# Altium project RFID_P5.PrjPcb (part 1 of 2)
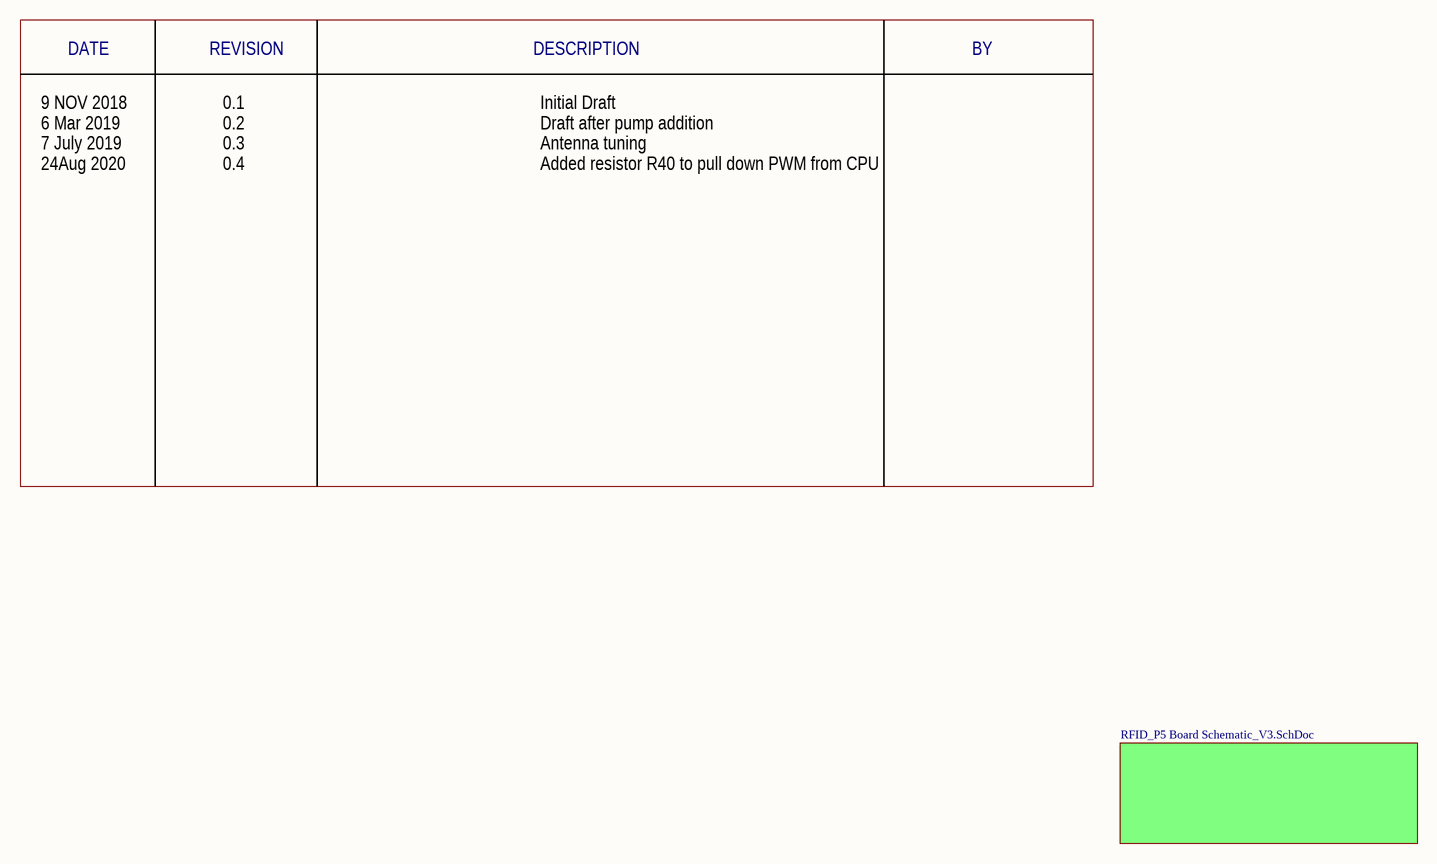
[diagram p0: Revision History.SchDoc]
7 sheets, 289 parts. Net scope: hierarchical (ports join the sheet entries above them; power ports are global).
Board file: RFID_P5 PCB.PcbDoc
Sheets:
  Revision History.SchDoc
  RFID_P5 Board Schematic.SchDoc
    RFID = RFID_CU Schematic.SchDoc
    MCU = MCU_CU Schematic.SchDoc
    POWER = Power_CU Schematic.SchDoc
    CONN = Connector_CU Schematic.SchDoc
    PUMP = PUMP DRIVER Schematic.SchDoc

## Sheet Revision History.SchDoc: Title
size A3; Date: *******; ApprovedBy: *******; CheckedBy: None; Author: *******; CompanyName: *******; DrawnBy: Name; Engineer: *******; Organization: *******; Address1: *******; Address2: *******; Address3: *******; Address4: *******; DocumentNumber: Doc Num; Revision: *******; SheetNumber: 1; SheetTotal: *******; CurrentTime: *******; CurrentDate: *******; Time: *******; DocumentFullPathAndName: *******; DocumentName: *******; ModifiedDate: *******; ImagePath: *******; ProjectName: *******; Application_BuildNumber: *******

### Sub-sheets
? = RFID_P5 Board Schematic_V3.SchDoc (file not in this document): no entries

### Notes on the sheet
- DATE
- REVISION
- DESCRIPTION
- BY
- 9 NOV 2018
- 6 Mar 2019
- 0.1
- 0.2
- Initial Draft
- Draft after pump addition
- 7 July 2019
- 24Aug 2020
- 0.3
- 0.4
- Antenna tuning
- Added resistor R40 to pull down PWM from CPU
- Title:
- Drawn By:
- Page Contents:
- Ahmed - AA
- Checked By:
- Size:
- Date:
- File:
- License:
- Email:
- A4
- Number:
- Time:
- Revision:
- Sheet
- Website:
- of

## Sheet RFID_P5 Board Schematic.SchDoc: Title
size A3; SheetTitle: Project Schematic; ApprovalDate: dd/mm/yyyy; DesignedBy: Boris Sharff; PartName: RFID_P5 CU board; PageSetup: Record=PageOptions|CenterHorizontal=True|CenterVertical=True|PrintScale=1.00|XCorrection=1.00|YCorrection=1.00|PrintKind=1|BorderSize=5000000|LeftOffset=0|BottomOffset=0|Orientation=2|PaperLength=1000|PaperWidth=1000|Scale=100|PaperSource=7|PrintQuality=-3|MediaType=1|DitherType=10|PrintScaleMode=0|PaperKind=A4|PaperIndex=9; Title2: RFDID_P5 CU Board Project Schematic; Date: *******; ApprovedBy: *******; CheckedBy: None; Author: *******; CompanyName: *******; DrawnBy: Name; Engineer: *******; Organization: *******; Address1: *******; Address2: *******; Address3: *******; Address4: *******; DocumentNumber: Doc Num; Revision: *******; SheetNumber: 1; SheetTotal: *******; CurrentTime: *******; CurrentDate: *******; Time: *******; DocumentFullPathAndName: *******; DocumentName: *******; ModifiedDate: *******; ImagePath: *******; ProjectName: *******; Application_BuildNumber: *******
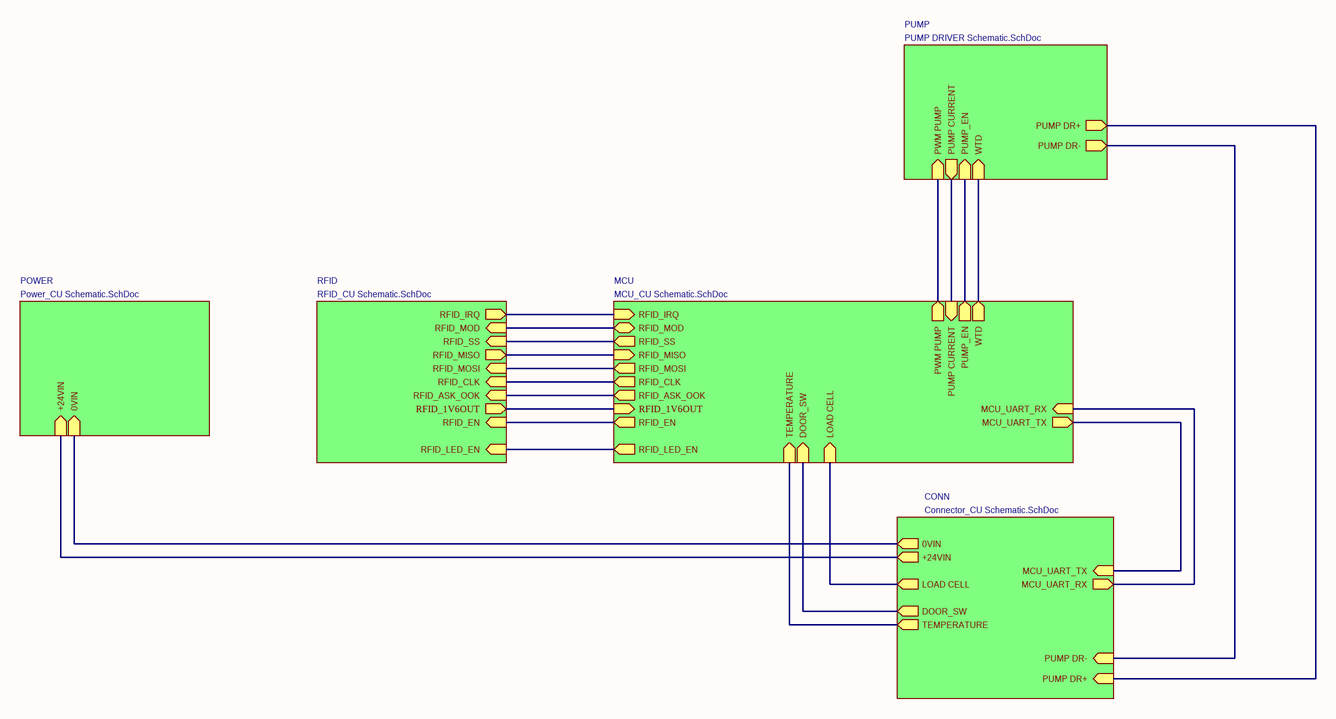
[diagram p1: RFID_P5 Board Schematic.SchDoc]

### Sub-sheets
CONN = Connector_CU Schematic.SchDoc: DOOR_SW (out), LOAD CELL (out), 0VIN (out), +24VIN (out), MCU_UART_RX (out), MCU_UART_TX (in), TEMPERATURE (out), PUMP DR+ (in), PUMP DR- (in)
MCU = MCU_CU Schematic.SchDoc: RFID_CLK (out), RFID_IRQ (in), RFID_EN (out), MCU_UART_TX (out), RFID_SS (out), RFID_MOD (bidir), MCU_UART_RX (in), DOOR_SW (in), RFID_MISO (in), RFID_MOSI (out), RFID_LED_EN (out), RFID_ASK_OOK (out), LOAD CELL (in), TEMPERATURE (in), RFID_1V6OUT (in), PWM PUMP (out), PUMP CURRENT (in), PUMP_EN (out), WTD (out)
POWER = Power_CU Schematic.SchDoc: +24VIN (in), 0VIN (in)
PUMP = PUMP DRIVER Schematic.SchDoc: PUMP DR- (out), PUMP DR+ (out), PWM PUMP (in), PUMP CURRENT (out), PUMP_EN (in), WTD (in)
RFID = RFID_CU Schematic.SchDoc: RFID_IRQ (out), RFID_SS (in), RFID_EN (in), RFID_CLK (in), RFID_MOD (in), RFID_LED_EN (in), RFID_MOSI (in), RFID_MISO (out), RFID_ASK_OOK (in), RFID_1V6OUT (out)

### Nets
0VIN: sheet POWER/0VIN, sheet CONN/0VIN
+24VIN: sheet POWER/+24VIN, sheet CONN/+24VIN
RFID_ASK_OOK: sheet RFID/RFID_ASK_OOK, sheet MCU/RFID_ASK_OOK
RFID_CLK: sheet RFID/RFID_CLK, sheet MCU/RFID_CLK
RFID_EN: sheet RFID/RFID_EN, sheet MCU/RFID_EN
RFID_IRQ: sheet RFID/RFID_IRQ, sheet MCU/RFID_IRQ
RFID_LED_EN: sheet RFID/RFID_LED_EN, sheet MCU/RFID_LED_EN
RFID_MISO: sheet RFID/RFID_MISO, sheet MCU/RFID_MISO
RFID_MOD: sheet RFID/RFID_MOD, sheet MCU/RFID_MOD
RFID_MOSI: sheet RFID/RFID_MOSI, sheet MCU/RFID_MOSI
RFID_SS: sheet RFID/RFID_SS, sheet MCU/RFID_SS
NetC3_1: sheet MCU/DOOR_SW, sheet CONN/DOOR_SW
NetC8_1: sheet MCU/LOAD CELL, sheet CONN/LOAD CELL
NetC85_2: sheet RFID/RFID_1V6OUT, sheet MCU/RFID_1V6OUT
NetC99_1: sheet MCU/TEMPERATURE, sheet CONN/TEMPERATURE
NetC108_1: sheet CONN/PUMP DR+, sheet PUMP/PUMP DR+
NetJ6_1: sheet CONN/PUMP DR-, sheet PUMP/PUMP DR-
NetR40_2: sheet MCU/PWM PUMP, sheet PUMP/PWM PUMP
NetTP3_TP: sheet MCU/MCU_UART_TX, sheet CONN/MCU_UART_TX
NetTP5_TP: sheet MCU/MCU_UART_RX, sheet CONN/MCU_UART_RX
NetU4_20: sheet MCU/WTD, sheet PUMP/WTD
NetU4_21: sheet MCU/PUMP_EN, sheet PUMP/PUMP_EN
NetU4_79: sheet MCU/PUMP CURRENT, sheet PUMP/PUMP CURRENT

### Notes on the sheet
- Title:
- Drawn By:
- Page Contents:
- Ahmed - AA
- Checked By:
- Size:
- Date:
- File:
- License:
- Email:
- A4
- Number:
- Time:
- Revision:
- Sheet
- Website:
- of

## Sheet RFID_CU Schematic.SchDoc: Title
size A3; ApprovalDate: dd/mm/yyyy; PageSetup: Record=PageOptions|CenterHorizontal=True|CenterVertical=True|PrintScale=1.01|XCorrection=1.00|YCorrection=1.00|PrintKind=1|BorderSize=5000000|LeftOffset=0|BottomOffset=0|Orientation=2|PaperLength=1000|PaperWidth=1000|Scale=100|PaperSource=7|PrintQuality=600|MediaType=1|DitherType=10|PaperKind=A3 (297 x 420mm)|PrintScaleMode=1; Title2: RFID_CU Schematic; Date: *******; ApprovedBy: *******; CheckedBy: None; Author: *******; CompanyName: *******; DrawnBy: Name; Engineer: *******; Organization: *******; Address1: *******; Address2: *******; Address3: *******; Address4: *******; DocumentNumber: Doc Num; Revision: *******; SheetNumber: 1; SheetTotal: *******; CurrentTime: *******; CurrentDate: *******; Time: *******; DocumentFullPathAndName: *******; DocumentName: *******; ModifiedDate: *******; ImagePath: *******; ProjectName: *******; Application_BuildNumber: *******
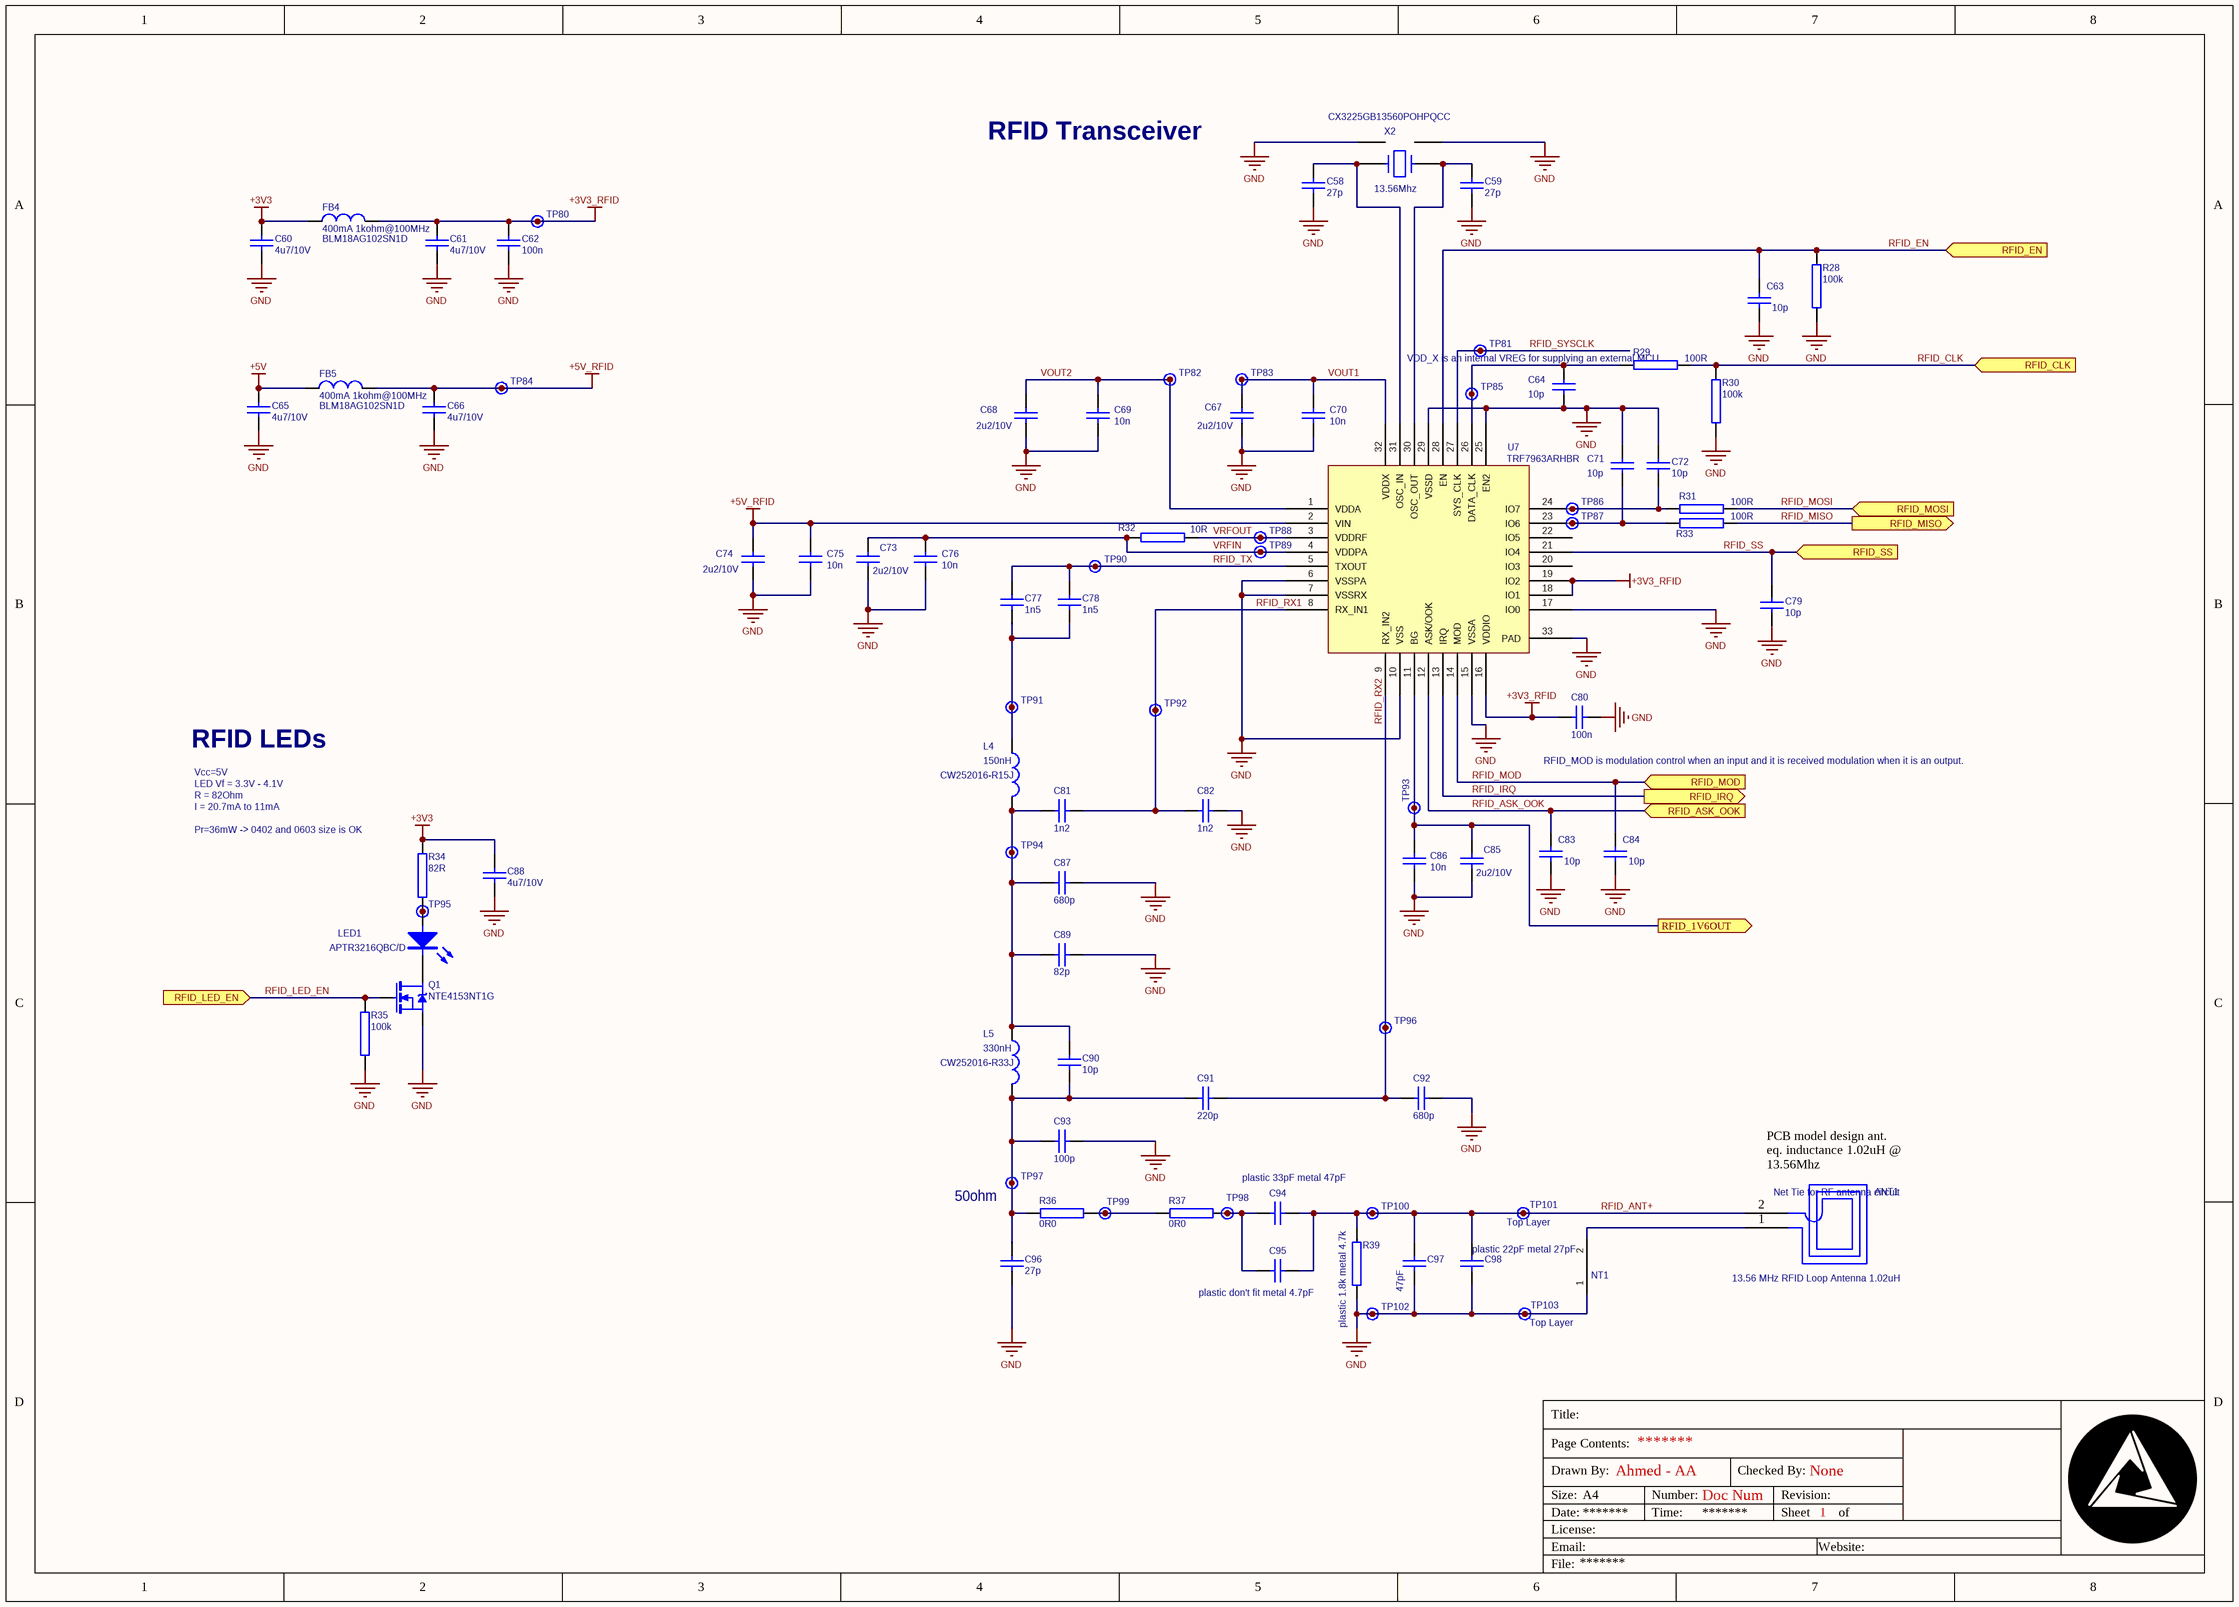
[diagram p2: RFID_CU Schematic.SchDoc]

### Parts
ANT1  Loop Antenna  [loop_antenna]  (value not drawn)
C58  27p  [CAPC1608X09N(0603)]
C59  27p  [CAPC1608X09N(0603)]
C60  4u7/10V  [CAPC1608X09N(0603)]
C61  4u7/10V  [CAPC1608X09N(0603)]
C62  100n  [CAPC1608X09N(0603)]
C63  10p  [CAPC1608X09N(0603)]
C64  10p  [CAPC1608X09N(0603)]
C65  4u7/10V  [CAPC1608X09N(0603)]
C66  4u7/10V  [CAPC1608X09N(0603)]
C67  2u2/10V  [CAPC1608X09N(0603)]
C68  2u2/10V  [CAPC1608X09N(0603)]
C69  10n  [CAPC1608X09N(0603)]
C70  10n  [CAPC1608X09N(0603)]
C71  10p  [CAPC1608X09N(0603)]
C72  10p  [CAPC1608X09N(0603)]
C73  2u2/10V  [CAPC1608X09N(0603)]
C74  2u2/10V  [CAPC1608X09N(0603)]
C75  10n  [CAPC1608X09N(0603)]
C76  10n  [CAPC1608X09N(0603)]
C77  1n5  [CAPC1608X09N(0603)]
C78  1n5  [CAPC1608X09N(0603)]
C79  10p  [CAPC1608X09N(0603)]
C80  100n  [CAPC1608X09N(0603)]
C81  1n2  [CAPC1608X09N(0603)]
C82  1n2  [CAPC1608X09N(0603)]
C83  10p  [CAPC1608X09N(0603)]
C84  10p  [CAPC1608X09N(0603)]
C85  2u2/10V  [CAPC1608X09N(0603)]
C86  10n  [CAPC1608X09N(0603)]
C87  680p  [CAPC1608X09N(0603)]
C88  4u7/10V  [CAPC1608X09N(0603)]
C89  82p  [CAPC1608X09N(0603)]
C90  10p  [CAPC1608X09N(0603)]
C91  220p  [CAPC1608X09N(0603)]
C92  680p  [CAPC1608X09N(0603)]
C93  100p  [CAPC1608X09N(0603)]
C94  plastic 33pF metal 47pF  [CAPC1608X09N(0603)]
C95  plastic don't fit metal 4.7pF  [CAPC1608X09N(0603)]
C96  27p  [CAPC1608X09N(0603)]
C97  47pF  [CAPC1608X09N(0603)]
C98  plastic 22pF metal 27pF  [CAPC1608X09N(0603)]
FB4  400mA 1kohm@100MHz  [RESC1608X06N]
FB5  400mA 1kohm@100MHz  [RESC1608X06N]
L4  150nH  02 Part Number: CW252016-R15J  [CW252016]
L5  330nH  02 Part Number: CW252016-R33J  [CW252016]
LED1  APTR3216QBC/D  [APTR3216QBC/D]
NT1  Net Tie  [0.15mm Net Tie]  (value not drawn)  (net tie, no BOM)
Q1  NTE4153NT1G  [SC-89]
R28  100k  [RESC1608X06N(0603)]
R29  100R  [RESC1608X06N(0603)]
R30  100k  [RESC1608X06N(0603)]
R31  100R  [RESC1608X06N(0603)]
R32  10R  [RESC1608X06N(0603)]
R33  100R  [RESC1608X06N(0603)]
R34  82R  [RESC1608X06N(0603)]
R35  100k  [RESC1608X06N(0603)]
R36  0R0  [RESC1608X06N(0603)]
R37  0R0  [RESC1608X06N(0603)]
R39  plastic 1.8k metal 4.7k  [RESC1608X06N(0603)]
TP80  LFX_P  [Test Point 1mm]  (value not drawn)  (no BOM)
TP81  LFX_P  [Test Point 1mm]  (value not drawn)  (no BOM)
TP82  LFX_P  [Test Point 1mm]  (value not drawn)  (no BOM)
TP83  LFX_P  [Test Point 1mm]  (value not drawn)  (no BOM)
TP84  LFX_P  [Test Point 1mm]  (value not drawn)  (no BOM)
TP85  LFX_P  [Test Point 1mm]  (value not drawn)  (no BOM)
TP86  LFX_P  [Test Point 1mm]  (value not drawn)  (no BOM)
TP87  LFX_P  [Test Point 1mm]  (value not drawn)  (no BOM)
TP88  LFX_P  [Test Point 1mm]  (value not drawn)  (no BOM)
TP89  LFX_P  [Test Point 1mm]  (value not drawn)  (no BOM)
TP90  LFX_P  [Test Point 1mm]  (value not drawn)  (no BOM)
TP91  LFX_P  [Test Point 1mm]  (value not drawn)  (no BOM)
TP92  LFX_P  [Test Point 1mm]  (value not drawn)  (no BOM)
TP93  LFX_P  [Test Point 1mm]  (value not drawn)  (no BOM)
TP94  LFX_P  [Test Point 1mm]  (value not drawn)  (no BOM)
TP95  LFX_P  [Test Point 1mm]  (value not drawn)  (no BOM)
TP96  LFX_P  [Test Point 1mm]  (value not drawn)  (no BOM)
TP97  50ohm  [Test Point 1mm]  (no BOM)
TP98  LFX_P  [Test Point 1mm]  (value not drawn)  (no BOM)
TP99  LFX_P  [Test Point 1mm]  (value not drawn)  (no BOM)
TP100  LFX_P  [Test Point 1mm]  (value not drawn)  (no BOM)
TP101  Notes: Top Layer  [Test Point 1mm]  (hidden comment: LFX_P)  (no BOM)
TP102  LFX_P  [Test Point 1mm]  (value not drawn)  (no BOM)
TP103  Notes: Top Layer  [Test Point 1mm]  (hidden comment: LFX_P)  (no BOM)
U7  TRF7963ARHBR  [QFN-32]
X2  13.56Mhz  02 Part Number: CX3225GB13560POHPQCC  [CX3225GB13560D0HEQCC]

### Ports
RFID_1V6OUT (out), RFID_ASK_OOK (in), RFID_CLK (in), RFID_EN (in), RFID_IRQ (out), RFID_LED_EN (in), RFID_MISO (out), RFID_MOD (in), RFID_MOSI (in), RFID_SS (in)

### Nets
+3V3: C60.2 C88.2 FB4.1 R34.2
+3V3_RFID: C61.2 C62.2 C80.2 FB4.2 TP80.TP U7.16(VDDIO) U7.18(IO1) U7.19(IO2)
+5V: C65.2 FB5.1
+5V_RFID: C66.2 C74.2 C75.2 FB5.2 TP84.TP U7.2(VIN)
GND: C58.1 C59.1 C60.1 C61.1 C62.1 C63.2 C64.2 C65.1 C66.1 C67.1 C68.1 C69.1 C70.1 C71.1 C72.1 C73.1 C74.1 C75.1 C76.1 C79.2 C80.1 C82.1 C83.2 C84.2 C85.1 C86.1 C87.1 C88.1 C89.1 C92.1 C93.1 C96.1 C97.2 C98.2 NT1.1 Q1.S R28.1 R30.1 R35.1 R39.1 TP102.TP TP103.TP U7.6(VSSPA) U7.7(VSSRX) U7.10(VSS) U7.15(VSSA) U7.17(IO0) U7.25(EN2) U7.29(VSSD) U7.33(PAD) X2.2 X2.4  [project net AN GND]
RFID_ANT+: C94.1 C95.1 C97.1 C98.1 R39.2 TP100.TP TP101.TP
RFID_ASK_OOK: C83.1 U7.12(ASK/OOK) ; port RFID_ASK_OOK
RFID_CLK: R29.2 R30.2 ; port RFID_CLK
RFID_EN: C63.1 R28.2 U7.28(EN) ; port RFID_EN
RFID_IRQ: U7.13(IRQ) ; port RFID_IRQ
RFID_LED_EN: Q1.G R35.2 ; port RFID_LED_EN
RFID_MISO: R33.2 ; port RFID_MISO
RFID_MOD: C84.1 U7.14(MOD) ; port RFID_MOD
RFID_MOSI: R31.2 ; port RFID_MOSI
RFID_RX1: C81.1 C82.2 TP92.TP U7.8(RX_IN1)
RFID_RX2: C91.1 C92.2 TP96.TP U7.9(RX_IN2)
RFID_SS: C79.1 U7.21(IO4) ; port RFID_SS
RFID_SYSCLK: TP81.TP U7.27(SYS_CLK)
RFID_TX: C77.2 C78.2 TP90.TP U7.5(TXOUT)
VOUT1: C67.2 C70.2 TP83.TP U7.32(VDDX)
VOUT2: C68.2 C69.2 TP82.TP U7.1(VDDA)
VRFIN: C73.2 C76.2 R32.1 TP89.TP U7.4(VDDPA)
VRFOUT: R32.2 TP88.TP U7.3(VDDRF)
NetC58_2: C58.2 U7.31(OSC_IN) X2.3
NetC59_2: C59.2 U7.30(OSC_OUT) X2.1
NetC64_1: C64.1 R29.1 TP85.TP U7.26(DATA_CLK)
NetC71_2: C71.2 R33.1 TP87.TP U7.23(IO6)
NetC72_2: C72.2 R31.1 TP86.TP U7.24(IO7)
NetC77_1: C77.1 C78.1 L4.1 TP91.TP
NetC81_2: C81.2 C87.2 C89.2 C90.1 L4.2 L5.1 TP94.TP
NetC85_2: C85.2 C86.2 TP93.TP U7.11(BG) ; port RFID_1V6OUT
NetC90_2: C90.2 C91.2 C93.2 C96.2 L5.2 R36.1 TP97.TP
NetC94_2: C94.2 C95.2 R37.2 TP98.TP
NetLED1_A: LED1.A R34.1 TP95.TP
NetLED1_K: LED1.K Q1.D
NetR36_2: R36.2 R37.1 TP99.TP

Not connected (* = marked no-connect by the designer): ANT1 1 2; NT1 2; U7 20(IO3) 22(IO5)

### Notes on the sheet
- RFID Transceiver
- VDD_X is an internal VREG for supplying an external MCU
- RFID LEDs
- (near C80) RFID_MOD is modulation control when an input and it is received modulation when it is an output.
- (near R34) Vcc=5V
  LED Vf = 3.3V - 4.1V
  R = 82Ohm
  I = 20.7mA to 11mA
  Pr=36mW -> 0402 and 0603 size is OK
- (near ANT1) PCB model design ant. eq. inductance 1.02uH @ 13.56Mhz
- (near ANT1) Net Tie for RF antenna circuit
- (near ANT1) 13.56 MHz RFID Loop Antenna 1.02uH
- Title:
- Drawn By:
- Page Contents:
- Ahmed - AA
- Checked By:
- Size:
- Date:
- File:
- License:
- Email:
- A4
- Number:
- Time:
- Revision:
- Sheet
- Website:
- of

### Library data of the parts
ANT1 = LOOP ANT: FPC Loop Antenna; 02 Part Number: P0000475; 01 Part Category: Atenna; 12 Author: M.Fineschi; 03 Description: FPC Loop Antenna; 04 Value: P0000475
C58 C59 = GRM1885C1H180FA01D: Capacitor, Ceramic, 50V, Tin plated, ±1%, ±30ppm/C, C0G, 100mohm, -55°C to 125°C; 08 Manufacturer: Murata Electronics North America; 04 Value: 18p; 06 Package: 0603; 12 Author: D.Grace; 05 Footprint Type: SMD; 02 Part Number: GRM1885C1H180FA01D; 03 Description: Capacitor, Ceramic, 50V, Tin plated, ±1%, ±30ppm/C, C0G, 100mohm, -55°C to 125°C; 01 Part Category: Capacitor; 09 Digikey PN: GRM1885C1H180FA01D-ND; 10 Alternate Supplier: Mouser; 11 Alternate Supplier PN: 81-GRM1885C1H180FA; ComponentLink1Description: Datasheet; ComponentLink1URL: L:\Datasheet\Capacitor\Chip Monolithic Ceramic Caps.pdf
C60 C61 C65 C66 C88 = CC0603KRX5R6BB475: Capacitor, Ceramic, 10V, ±10%, X5R, -55°C to 125°C; 08 Manufacturer: Yageo; 04 Value: 4u7; 06 Package: 0603; 12 Author: K.Sukumar; 05 Footprint Type: SMD; 02 Part Number: CC0603KRX5R6BB475; 03 Description: Capacitor, Ceramic, 10V, ±10%, X5R, -55°C to 125°C; 01 Part Category: Capacitor; 09 Digikey PN: 311-1455-2-ND; ComponentLink1Description: Datasheet; ComponentLink1URL: L:\Datasheet\Capacitor\mlcc01_e.pdf
C62 C80 = GRM188R71H104KA93D: Capacitor, Ceramic, 50V, ±10%, X7R, -55°C to 125°C; 08 Manufacturer: Murata Electronics North America; 06 Package: 0603; 12 Author: D.Grace; 05 Footprint Type: SMD; 02 Part Number: GRM188R71H104KA93D; 03 Description: Capacitor, Ceramic, 50V, ±10%, X7R, -55°C to 125°C; 04 Value: 100n; 01 Part Category: Capacitor; 09 Digikey PN: 490-1519-2-ND; ComponentLink1Description: Datasheet; ComponentLink1URL: L:\Datasheet\Capacitor\c02e.pdf
C63 C64 C71 C72 C79 C83 C84 C90 = GQM1885C1H100JB01D: Capacitor, Ceramic, 50V, ±5%, NP0, -55°C to 125°C; 08 Manufacturer: Murata Electronics North America; 06 Package: 0603; 12 Author: M.Fineschi; 05 Footprint Type: SMD; 02 Part Number: GQM1885C1H100JB01D; 03 Description: Capacitor, Ceramic, 50V, ±5%, NP0, -55°C to 125°C; 04 Value: 10p; 01 Part Category: Capacitor; 09 Digikey PN: 490-3570-1-ND; ComponentLink1Description: Datasheet; ComponentLink1URL: L:\Datasheet\Capacitor\c02e.pdf
C67 C68 C73 C74 C85 = GRM188R71A225KE15D: Capacitor, Ceramic, 10V, ±10%, X7R, -55°C to 125°C; 08 Manufacturer: Murata Electronics North America; 04 Value: 2u2; 06 Package: 0603; 12 Author: D.Grace; 05 Footprint Type: SMD; 02 Part Number: GRM188R71A225KE15D; 03 Description: Capacitor, Ceramic, 10V, ±10%, X7R, -55°C to 125°C; 01 Part Category: Capacitor; 09 Digikey PN: 490-4520-2-ND; ComponentLink1Description: Datasheet; ComponentLink1URL: L:\Datasheet\Capacitor\c02e.pdf
C69 C70 C75 C76 C86 = GRM188R71H103KA01D: Capacitor, Ceramic, 50V, ±10%, X7R, -55°C to 125°C; 08 Manufacturer: Murata Electronics North America; 06 Package: 0603; 12 Author: D.Grace; 05 Footprint Type: SMD; 02 Part Number: GRM188R71H103KA01D; 03 Description: Capacitor, Ceramic, 50V, ±10%, X7R, -55°C to 125°C; 04 Value: 10n; 01 Part Category: Capacitor; 09 Digikey PN: 490-1512-2-ND; ComponentLink1Description: Datasheet; ComponentLink1URL: L:\Datasheet\Capacitor\c02e.pdf
C77 C78 = GRM188R71H152KA01D: Capacitor, Ceramic, 50V, ±10%, X7R, -55°C to 125°C; 08 Manufacturer: Murata Electronics North America; 06 Package: 0603; 12 Author: M.Fineschi; 05 Footprint Type: SMD; 02 Part Number: GRM188R71H152KA01D; 03 Description: Capacitor, Ceramic, 50V, ±10%, X7R, -55°C to 125°C; 04 Value: 1n5; 01 Part Category: Capacitor; 09 Digikey PN: 490-1498-1-ND; ComponentLink1Description: Datasheet; ComponentLink1URL: L:\Datasheet\Capacitor\c02e.pdf
C81 C82 = GRM188R71H122KA01D: Capacitor, Ceramic, 50V, ±10%, X7R, -55°C to 125°C; 08 Manufacturer: Murata Electronics North America; 06 Package: 0603; 12 Author: M.Fineschi; 05 Footprint Type: SMD; 02 Part Number: GRM188R71H122KA01D; 03 Description: Capacitor, Ceramic, 50V, ±10%, X7R, -55°C to 125°C; 04 Value: 1n2; 01 Part Category: Capacitor; 09 Digikey PN: 490-1496-1-ND; ComponentLink1Description: Datasheet; ComponentLink1URL: L:\Datasheet\Capacitor\c02e.pdf
C87 C92 = GRM188R71H681KA01D: Capacitor, Ceramic, 50V, ±10%, X7R, -55°C to 125°C; 08 Manufacturer: Murata Electronics North America; 06 Package: 0603; 12 Author: M.Fineschi; 05 Footprint Type: SMD; 02 Part Number: GRM188R71H681KA01D; 03 Description: Capacitor, Ceramic, 50V, ±10%, X7R, -55°C to 125°C; 04 Value: 680p; 01 Part Category: Capacitor; 09 Digikey PN: 490-1491-1-ND; ComponentLink1Description: Datasheet; ComponentLink1URL: L:\Datasheet\Capacitor\c02e.pdf
C89 = GRM1885C1H820JA01D: Capacitor, Ceramic, 50V, ±5%, NP0, -55°C to 125°C; 08 Manufacturer: Murata Electronics North America; 06 Package: 0603; 12 Author: M.Fineschi; 05 Footprint Type: SMD; 02 Part Number: GRM1885C1H820JA01D; 03 Description: Capacitor, Ceramic, 50V, ±5%, NP0, -55°C to 125°C; 04 Value: 82p; 01 Part Category: Capacitor; 09 Digikey PN: 490-1425-1-ND; ComponentLink1Description: Datasheet; ComponentLink1URL: L:\Datasheet\Capacitor\c02e.pdf
C91 = GRM188R71H221KA01D: Capacitor, Ceramic, 50V, ±10%, X7R, -55°C to 125°C; 08 Manufacturer: Murata Electronics North America; 06 Package: 0603; 12 Author: M.Fineschi; 05 Footprint Type: SMD; 02 Part Number: GRM188R71H221KA01D; 03 Description: Capacitor, Ceramic, 50V, ±10%, X7R, -55°C to 125°C; 04 Value: 220p; 01 Part Category: Capacitor; 09 Digikey PN: 490-1483-1-ND; ComponentLink1Description: Datasheet; ComponentLink1URL: L:\Datasheet\Capacitor\c02e.pdf
C93 = GRM1885C1H101JA01D: Capacitor, Ceramic, 50V, ±5%, C0G NP0, -55°C to 125°C; 08 Manufacturer: Murata Electronics North America; 06 Package: 0603; 12 Author: D.Grace; 05 Footprint Type: SMD; 02 Part Number: GRM1885C1H101JA01D; 03 Description: Capacitor, Ceramic, 50V, ±5%, C0G NP0, -55°C to 125°C; 04 Value: 100p; 01 Part Category: Capacitor; 09 Digikey PN: 490-1427-2-ND; 10 Alternate Supplier: Mouser; 11 Alternate Supplier PN: 81-GRM39C101J50; ComponentLink1Description: Datasheet; ComponentLink1URL: L:\Datasheet\Capacitor\c02e.pdf
C94 = GRM1885C1H470JA01D: Capacitor, Ceramic, 50V, ±5%, NP0, -55°C to 125°C; 08 Manufacturer: Murata Electronics North America; 06 Package: 0603; 12 Author: M.Fineschi; 05 Footprint Type: SMD; 02 Part Number: GRM1885C1H470JA01D; 03 Description: Capacitor, Ceramic, 50V, ±5%, NP0, -55°C to 125°C; 01 Part Category: Capacitor; 09 Digikey PN: 490-1419-1-ND; ComponentLink1Description: Datasheet; ComponentLink1URL: L:\Datasheet\Capacitor\c02e.pdf
C95 = GQM1885C1H100JB01D: Capacitor, Ceramic, 50V, ±5%, NP0, -55°C to 125°C; 08 Manufacturer: Murata Electronics North America; 04 Value: 22pF; 06 Package: 0603; 12 Author: M.Fineschi; 05 Footprint Type: SMD; 02 Part Number: GQM1885C1H100JB01D; 03 Description: Capacitor, Ceramic, 50V, ±5%, NP0, -55°C to 125°C; 01 Part Category: Capacitor; 09 Digikey PN: 490-3570-1-ND; ComponentLink1Description: Datasheet; ComponentLink1URL: L:\Datasheet\Capacitor\c02e.pdf
C96 = GRM1885C1H270JA01D: Capacitor, Ceramic, 50V, ±5%, NP0, -55°C to 125°C; 08 Manufacturer: Murata Electronics North America; 06 Package: 0603; 12 Author: M.Fineschi; 05 Footprint Type: SMD; 02 Part Number: GRM1885C1H270JA01D; 03 Description: Capacitor, Ceramic, 50V, ±5%, NP0, -55°C to 125°C; 04 Value: 27p; 01 Part Category: Capacitor; 09 Digikey PN: 490-1413-1-ND; ComponentLink1Description: Datasheet; ComponentLink1URL: L:\Datasheet\Capacitor\c02e.pdf
C97 = GRM1885C1H820JA01D: Capacitor, Ceramic, 50V, ±5%, NP0, -55°C to 125°C; 08 Manufacturer: Murata Electronics North America; 04 Value: 100p; 06 Package: 0603; 12 Author: M.Fineschi; 05 Footprint Type: SMD; 02 Part Number: GRM1885C1H820JA01D; 03 Description: Capacitor, Ceramic, 50V, ±5%, NP0, -55°C to 125°C; 01 Part Category: Capacitor; 09 Digikey PN: 490-1425-1-ND; ComponentLink1Description: Datasheet; ComponentLink1URL: L:\Datasheet\Capacitor\c02e.pdf
C98 = GRM1885C1H101JA01D: Capacitor, Ceramic, 50V, ±5%, C0G NP0, -55°C to 125°C; 08 Manufacturer: Murata Electronics North America; 04 Value: 10p; 06 Package: 0603; 12 Author: D.Grace; 05 Footprint Type: SMD; 02 Part Number: GRM1885C1H101JA01D; 03 Description: Capacitor, Ceramic, 50V, ±5%, C0G NP0, -55°C to 125°C; 01 Part Category: Capacitor; 09 Digikey PN: 490-1427-2-ND; 10 Alternate Supplier: Mouser; 11 Alternate Supplier PN: 81-GRM39C101J50; ComponentLink1Description: Datasheet; ComponentLink1URL: L:\Datasheet\Capacitor\c02e.pdf
FB4 FB5 = BLM18AG102SN1D: Ferrite Bead, 1kohm@100MHz, 400mA, 500mohm, -55 to 125C; 01 Part Category: Filter; 08 Manufacturer: Murata; 06 Package: 0603; 05 Footprint Type: SMD; 12 Author: M.Fineschi; 02 Part Number: BLM18AG102SN1D; 03 Description: Ferrite Bead, 1kohm@100MHz, 400mA, 500mohm, -55 to 125C; 04 Value: 1kohm@100MHz; ComponentLink1Description: Datasheet; ComponentLink1URL: L:\Datasheet\Filter\L0110S0100BLM18A.pdf; 09 Digikey PN: 490-1015-2-ND; 10 Alternate Supplier: BLM18AG102SN1D
L4 = CW252016-R15J_PA: Inductor, 150nH , I = 500mA, 220 mOhm, SRF 850MHz, ±5%; 01 Part Category: Passive; 08 Manufacturer: Bourns Inc; 06 Package: 1008; 05 Footprint Type: SMD; 12 Author: D.Grace; 13 Reviewed By: P.Moutzouris; 03 Description: Inductor, 150nH , I = 500mA, 220 mOhm, SRF 850MHz, ±5%; 04 Value: 150nH; ComponentLink1Description: Datasheet; ComponentLink1URL: L:\Datasheet\Inductor\CW252016.pdf; 09 Digikey PN: CW252016-R15JTR-ND
L5 = CW252016-R33J_PA: Inductor, 330nH , I = 500mA, 900 mOhm, SRF 570MHz, ±5%; 01 Part Category: Passive; 08 Manufacturer: Bourns Inc; 06 Package: 1008; 05 Footprint Type: SMD; 12 Author: D.Grace; 13 Reviewed By: P.Moutzouris; 03 Description: Inductor, 330nH , I = 500mA, 900 mOhm, SRF 570MHz, ±5%; 04 Value: 330nH; ComponentLink1Description: Datasheet; ComponentLink1URL: L:\Datasheet\Inductor\CW252016.pdf; 09 Digikey PN: CW252016-R33JTR-ND
LED1 = KPTR-3216ZGC: LED, TopEntry, Blue, 4000mcd, 20mA, Vf=3V3; 01 Part Category: Discrete; 08 Manufacturer: Kingbright; 06 Package: 1206; 05 Footprint Type: SMD; 12 Author: M.Fineschi; 03 Description: LED, Top Entry, Blue, 4000mcd, 20mA, Vf=3V3; 04 Value: APTR3216QBC/D; ComponentLink1Description: Datasheet; 09 Digikey PN: -; 10 Alternate Supplier: Element14; 11 Alternate Supplier PN: 2217988; 02 Part Number: APTR3216QBC/D
Q1 = NTE4153NT1G: MOSFET, N-Channel, Logic Level, 0.5Ohm @ 1.5V, Vds 50V, Id 915mA, 300mW; 01 Part Category: Discrete; 08 Manufacturer: On Semiconductor; 05 Footprint Type: SMD; 12 Author: D.Grace; 02 Part Number: NTE4153NT1G; 03 Description: Logic Level, 0.5Ohm @ 1.5V, Vds 50V, Id 915mA, 300mW; 04 Value: NTE4153NT1G; 06 Package: SC-89; ComponentLink1Description: Datasheet; ComponentLink1URL: L:\Datasheet\Discrete\NTA4153N-D.pdf; 09 Digikey PN: NTE4153NT1GOSTR-ND
R28 R30 R35 = RC0603FR-07100KL: Resistor, Thick Film, 0.1W, ±1%, ±100ppm/°C; 08 Manufacturer: Yageo; 13 Reviewed By: P.Moutzouris; 06 Package: 0603; 12 Author: D.Grace; 05 Footprint Type: SMD; 02 Part Number: RC0603FR-07100KL; 03 Description: Resistor, Thick Film, 0.1W, ±1%, ±100ppm/°C; 04 Value: 100k; 09 Digikey PN: 311-100KHRTR-ND; 01 Part Category: Resistor; ComponentLink1Description: Datasheet; ComponentLink1URL: L:\Datasheet\Resistor\PYu-RC0603_51_RoHS_L_4.pdf
R29 R31 R33 = RC0603FR-07100RL: Resistor, Thick Film, 0.1W, ±1%, ±100ppm/°C; 08 Manufacturer: Yageo; 13 Reviewed By: P.Moutzouris; 06 Package: 0603; 12 Author: D.Grace; 05 Footprint Type: SMD; 02 Part Number: RC0603FR-07100RL; 03 Description: Resistor, Thick Film, 0.1W, ±1%, ±100ppm/°C; 04 Value: 100R; 09 Digikey PN: 311-100HRTR-ND; 01 Part Category: Resistor; ComponentLink1Description: Datasheet; ComponentLink1URL: L:\Datasheet\Resistor\PYu-RC0603_51_RoHS_L_4.pdf
R32 = RC0603FR-0710RL: Resistor, Thick Film, 0.1W, ±1%, ±100ppm/°C; 08 Manufacturer: Yageo; 06 Package: 0603; 12 Author: M.Fineschi; 05 Footprint Type: SMD; 03 Description: Resistor, Thick Film, 0.1W, ±1%, ±100ppm/°C; 04 Value: 10R; 09 Digikey PN: 311-10.0HRCT-ND; 01 Part Category: Resistor; ComponentLink1Description: Datasheet; ComponentLink1URL: L:\Datasheet\Resistor\PYu-RC0603_51_RoHS_L_4.pdf; 02 Part Number: RC0603FR-0710RL
R34 = RC0603FR-0782RL: Resistor, Thick Film, 0.1W, ±1%, ±100ppm/°C; 08 Manufacturer: Yageo; 13 Reviewed By: P.Moutzouris; 06 Package: 0603; 12 Author: D.Grace; 05 Footprint Type: SMD; 02 Part Number: RC0603FR-0782RL; 03 Description: Resistor, Thick Film, 0.1W, ±1%, ±100ppm/°C; 04 Value: 82R; 09 Digikey PN: 311-82.0HRTR-ND; 01 Part Category: Resistor; ComponentLink1Description: Datasheet; ComponentLink1URL: L:\Datasheet\Resistor\PYu-RC0603_51_RoHS_L_4.pdf
R36 R37 = RC1608J000CS: Resistor, Thick Film, 0.1W, ±1%, ±100ppm/°C; 08 Manufacturer: Samsung Electro-Mechanics; 13 Reviewed By: P.Moutzouris; 06 Package: 0603; 12 Author: K.Sukumar; 05 Footprint Type: SMD; 02 Part Number: RC1608J000CS; 03 Description: Resistor, Thick Film, 0.1W, ±1%, ±100ppm/°C; 04 Value: 0R0; 09 Digikey PN: 1276-3510-2-ND; 01 Part Category: Resistor; ComponentLink1Description: Datasheet; ComponentLink1URL: L:\Datasheet\Resistor\Chip_Resistor.pdf
R39 = RC0603FR-071KL: Resistor, Thick Film, 0.1W, ±1%, ±100ppm/°C; 08 Manufacturer: Yageo; 13 Reviewed By: P.Moutzouris; 06 Package: 0603; 12 Author: D.Grace; 05 Footprint Type: SMD; 02 Part Number: RC0603FR-071KL; 03 Description: Resistor, Thick Film, 0.1W, ±1%, ±100ppm/°C; 04 Value: 1.8k; 09 Digikey PN: 311-1.00KHRTR-ND; 01 Part Category: Resistor; ComponentLink1Description: Datasheet; ComponentLink1URL: L:\Datasheet\Resistor\PYu-RC0603_51_RoHS_L_4.pdf
TP80-TP103 = Test Point: 01 Part Category: PCB; 12 Author: D.Grace
U7 = TRF7963ARHBR: RFID/NFC AFE 13.56MHZ; 01 Part Category: IC; 08 Manufacturer: TI; 03 Description: IC RFID FRONT END 13.56MHZ; 05 Footprint Type: SMD; 12 Author: K.Sukumar; 02 Part Number: TRF7963ARHBR; 04 Value: TRF7963ARHBR; 06 Package: QFN-32; ComponentLink1Description: Datasheet; ComponentLink1URL: L:\Datasheet\IC\trf7963a.pdf; 09 Digikey PN: TRF7963ARHBR-ND
X2 = 7A-13.560MAAJ-T: Crystal, 13.56Mhz, 18pF, +-30ppm, 50Ohm, Fundamental; 08 Manufacturer: AVX Corp/Kyocera Corp; 03 Description: CRYSTAL 13.56MHZ 27PF SMD; 06 Package: SMD-4; 05 Footprint Type: SMD; 12 Author: J.Orhan; 04 Value: CX3225GB13560POHPQCC; 01 Part Category: Crystal; ComponentLink1Description: Datasheet; ComponentLink1URL: L:\Datasheet\Crystal\CX3225GBxD0HEQ_Series_Spec.pdf; 09 Digikey PN: 1253-1173-1-ND

## Sheet MCU_CU Schematic.SchDoc: Title
size A3; SheetTitle: MCU_CU Schematic; ApprovalDate: dd/mm/yyyy; DesignedBy: Boris Sharff; PageSetup: Record=PageOptions|CenterHorizontal=True|CenterVertical=True|PrintScale=1.01|XCorrection=1.00|YCorrection=1.00|PrintKind=1|BorderSize=5000000|LeftOffset=0|BottomOffset=0|Orientation=2|PaperLength=1000|PaperWidth=1000|Scale=100|PaperSource=7|PrintQuality=600|MediaType=1|DitherType=10|PaperKind=A3 (297 x 420mm)|PrintScaleMode=1; Title2: MCU_CU Schematic; Date: *******; ApprovedBy: *******; CheckedBy: None; Author: *******; CompanyName: *******; DrawnBy: Name; Engineer: *******; Organization: *******; Address1: *******; Address2: *******; Address3: *******; Address4: *******; DocumentNumber: Doc Num; Revision: *******; SheetNumber: 1; SheetTotal: *******; CurrentTime: *******; CurrentDate: *******; Time: *******; DocumentFullPathAndName: *******; DocumentName: *******; ModifiedDate: *******; ImagePath: *******; ProjectName: *******; Application_BuildNumber: *******
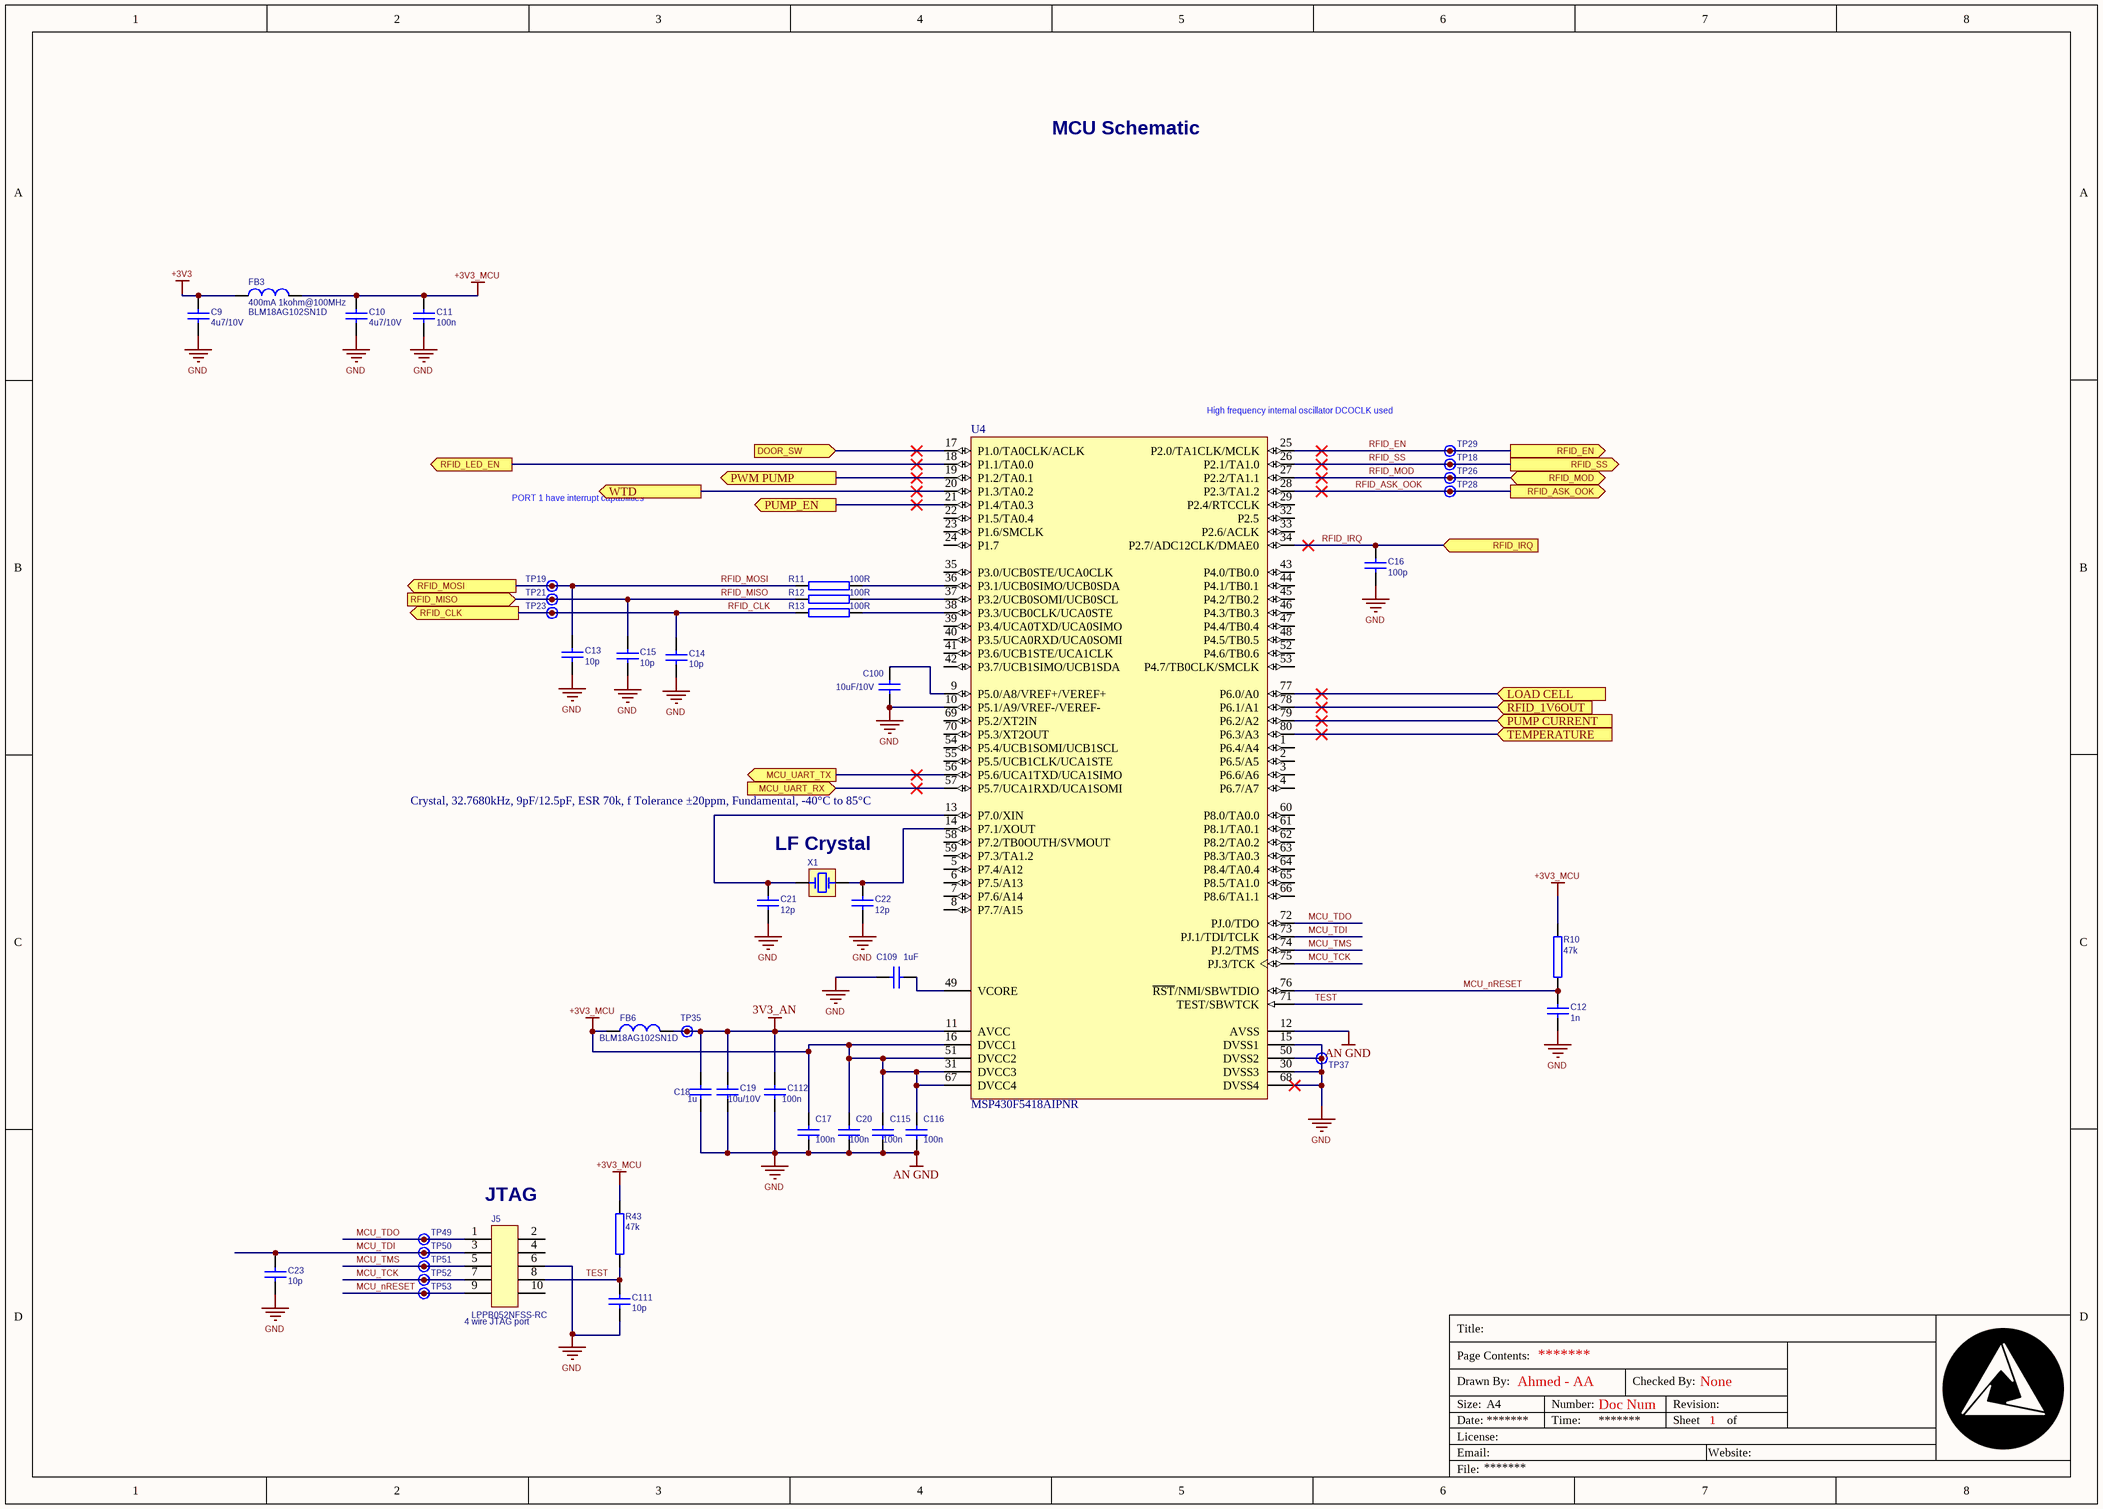
[diagram p3: MCU_CU Schematic.SchDoc]

### Parts
C9  4u7/10V  [CAPC1608X09N(0603)]
C10  4u7/10V  [CAPC1608X09N(0603)]
C11  100n  [CAPC1608X09N(0603)]
C12  1n  [CAPC1608X09N(0603)]
C13  10p  [CAPC1608X09N(0603)]
C14  10p  [CAPC1608X09N(0603)]
C15  10p  [CAPC1608X09N(0603)]
C16  100p  [CAPC1608X09N(0603)]
C17  100n  [CAPC1608X09N(0603)]
C18  1u  [CAPC1608X09N(0603)]
C19  10u/10V  [CAPC1608X09N(0603)]
C20  100n  [CAPC1608X09N(0603)]
C21  12p  [CAPC1608X09N(0603)]
C22  12p  [CAPC1608X09N(0603)]
C23  10p  [CAPC1608X09N(0603)]
C100  10uF/10V  [CAPC1608X09N(0603)]
C109  1uF  [CAPC1608X09N(0603)]
C111  10p  [CAPC1608X09N(0603)]
C112  100n  [CAPC1608X09N(0603)]
C115  100n  [CAPC1608X09N(0603)]
C116  100n  [CAPC1608X09N(0603)]
FB3  400mA 1kohm@100MHz  [RESC1608X06N]
FB6  400mA 1kohm@100MHz  [RESC1608X06N]  (value not drawn)
J5  LPPB052NFSS-RC  [2x 5, 1.27mm Pitch]
R10  47k  [RESC1608X06N(0603)]
R11  100R  [RESC1608X06N(0603)]
R12  100R  [RESC1608X06N(0603)]
R13  100R  [RESC1608X06N(0603)]
R43  47k  [RESC1608X06N(0603)]
TP18  LFX_P  [Test Point 1mm]  (value not drawn)  (no BOM)
TP19  LFX_P  [Test Point 1mm]  (value not drawn)  (no BOM)
TP21  LFX_P  [Test Point 1mm]  (value not drawn)  (no BOM)
TP23  LFX_P  [Test Point 1mm]  (value not drawn)  (no BOM)
TP26  LFX_P  [Test Point 1mm]  (value not drawn)  (no BOM)
TP28  LFX_P  [Test Point 1mm]  (value not drawn)  (no BOM)
TP29  LFX_P  [Test Point 1mm]  (value not drawn)  (no BOM)
TP35  LFX_P  [Test Point 1mm]  (value not drawn)  (no BOM)
TP37  LFX_P  [Test Point 1mm]  (value not drawn)  (no BOM)
TP49  TDO  [Test Point 1mm]  (value not drawn)  (no BOM)
TP50  TDO  [Test Point 1mm]  (value not drawn)  (no BOM)
TP51  TDO  [Test Point 1mm]  (value not drawn)  (no BOM)
TP52  TDO  [Test Point 1mm]  (value not drawn)  (no BOM)
TP53  TDO  [Test Point 1mm]  (value not drawn)  (no BOM)
U4  MSP430F5418AIPNR  [PN0080A_L]
X1  CM315D32768DZCT  [CM315D32768DZCT]  (value not drawn)

### Ports
DOOR_SW (in), LOAD CELL (in), MCU_UART_RX (in), MCU_UART_TX (out), PUMP CURRENT (in), PUMP_EN (out), PWM PUMP (out), RFID_1V6OUT (in), RFID_ASK_OOK (out), RFID_CLK (out), RFID_EN (out), RFID_IRQ (in), RFID_LED_EN (out), RFID_MISO (in), RFID_MOD (bidir), RFID_MOSI (out), RFID_SS (out), TEMPERATURE (in), WTD (out)

### Nets
3V3_AN: C18.2 C19.2 C112.2 FB6.2 TP35.TP U4.11(AVCC)
+3V3: C9.2 FB3.1
+3V3_MCU: C10.2 C11.2 C17.2 C20.2 C115.2 C116.2 FB3.2 FB6.1 R10.1 R43.1 U4.16(DVCC1) U4.31(DVCC3) U4.51(DVCC2) U4.67(DVCC4)
AN GND: C9.1 C10.1 C11.1 C12.1 C13.2 C14.2 C15.2 C16.1 C17.1 C18.1 C19.1 C20.1 C21.1 C22.1 C23.2 C100.1 C109.2 C111.2 C112.1 C115.1 C116.1 J5.6 TP37.TP U4.10(P5.1/A9/VREF-/VEREF-) U4.12(AVSS) U4.15(DVSS1) U4.30(DVSS3) U4.50(DVSS2) U4.68(DVSS4)  [also labelled GND]
MCU_nRESET: C12.2 J5.9 R10.2 TP53.TP U4.76(~{RST}/NMI/SBWTDIO)
MCU_TCK: J5.7 TP52.TP U4.75(PJ.3/TCK)
MCU_TDI: C23.1 J5.3 TP50.TP U4.73(PJ.1/TDI/TCLK)
MCU_TDO: J5.1 TP49.TP U4.72(PJ.0/TDO)
MCU_TMS: J5.5 TP51.TP U4.74(PJ.2/TMS)
RFID_ASK_OOK: TP28.TP U4.28(P2.3/TA1.2) ; port RFID_ASK_OOK
RFID_CLK: C14.1 R13.2 TP23.TP ; port RFID_CLK
RFID_EN: TP29.TP U4.25(P2.0/TA1CLK/MCLK) ; port RFID_EN
RFID_IRQ: C16.2 U4.34(P2.7/ADC12CLK/DMAE0) ; port RFID_IRQ
RFID_LED_EN: U4.18(P1.1/TA0.0) ; port RFID_LED_EN
RFID_MISO: C15.1 R12.2 TP21.TP ; port RFID_MISO
RFID_MOD: TP26.TP U4.27(P2.2/TA1.1) ; port RFID_MOD
RFID_MOSI: C13.1 R11.2 TP19.TP ; port RFID_MOSI
RFID_SS: TP18.TP U4.26(P2.1/TA1.0) ; port RFID_SS
TEST: C111.1 J5.8 R43.2 U4.71(TEST/SBWTCK)
NetC3_1: U4.17(P1.0/TA0CLK/ACLK) ; port DOOR_SW
NetC8_1: U4.77(P6.0/A0) ; port LOAD CELL
NetC21_2: C21.2 U4.13(P7.0/XIN) X1.1(HOT)
NetC22_2: C22.2 U4.14(P7.1/XOUT) X1.2(HOT)
NetC85_2: U4.78(P6.1/A1) ; port RFID_1V6OUT
NetC99_1: U4.80(P6.3/A3) ; port TEMPERATURE
NetC100_2: C100.2 U4.9(P5.0/A8/VREF+/VEREF+)
NetC109_1: C109.1 U4.49(VCORE)
NetR11_1: R11.1 U4.36(P3.1/UCB0SIMO/UCB0SDA)
NetR12_1: R12.1 U4.37(P3.2/UCB0SOMI/UCB0SCL)
NetR13_1: R13.1 U4.38(P3.3/UCB0CLK/UCA0STE)
NetR40_2: U4.19(P1.2/TA0.1) ; port PWM PUMP
NetTP3_TP: U4.56(P5.6/UCA1TXD/UCA1SIMO) ; port MCU_UART_TX
NetTP5_TP: U4.57(P5.7/UCA1RXD/UCA1SOMI) ; port MCU_UART_RX
NetU4_20: U4.20(P1.3/TA0.2) ; port WTD
NetU4_21: U4.21(P1.4/TA0.3) ; port PUMP_EN
NetU4_79: U4.79(P6.2/A2) ; port PUMP CURRENT

Not connected (* = marked no-connect by the designer): J5 2 4 10; U4 1(P6.4/A4) 2(P6.5/A5) 3(P6.6/A6) 4(P6.7/A7) 5(P7.4/A12) 6(P7.5/A13) 7(P7.6/A14) 8(P7.7/A15) 22(P1.5/TA0.4) 23(P1.6/SMCLK) 24(P1.7) 29(P2.4/RTCCLK) 32(P2.5) 33(P2.6/ACLK) 35(P3.0/UCB0STE/UCA0CLK) 39(P3.4/UCA0TXD/UCA0SIMO) 40(P3.5/UCA0RXD/UCA0SOMI) 41(P3.6/UCB1STE/UCA1CLK) 42(P3.7/UCB1SIMO/UCB1SDA) 43(P4.0/TB0.0) 44(P4.1/TB0.1) 45(P4.2/TB0.2) 46(P4.3/TB0.3) 47(P4.4/TB0.4) 48(P4.5/TB0.5) 52(P4.6/TB0.6) 53(P4.7/TB0CLK/SMCLK) 54(P5.4/UCB1SOMI/UCB1SCL) 55(P5.5/UCB1CLK/UCA1STE) 58(P7.2/TB0OUTH/SVMOUT) 59(P7.3/TA1.2) 60(P8.0/TA0.0) 61(P8.1/TA0.1) 62(P8.2/TA0.2) 63(P8.3/TA0.3) 64(P8.4/TA0.4) 65(P8.5/TA1.0) 66(P8.6/TA1.1) 69(P5.2/XT2IN) 70(P5.3/XT2OUT)

### Notes on the sheet
- MCU Schematic
- (near U4) High frequency internal oscillator DCOCLK used
- PORT 1 have interrupt capabilities
- LF Crystal
- (near J5) JTAG
- (near J5) 4 wire JTAG port
- Title:
- Drawn By:
- Page Contents:
- Ahmed - AA
- Checked By:
- Size:
- Date:
- File:
- License:
- Email:
- A4
- Number:
- Time:
- Revision:
- Sheet
- Website:
- of

### Library data of the parts
C9 C10 C100 = CC0603KRX5R6BB475: as C60 on sheet RFID_CU Schematic; 02 Part Number: CC0603KRX5R6BB475; 03 Description: Capacitor, Ceramic, 10V, ±10%, X5R, -55°C to 125°C; 01 Part Category: Capacitor; 09 Digikey PN: 311-1455-2-ND; ComponentLink1Description: Datasheet; ComponentLink1URL: L:\Datasheet\Capacitor\mlcc01_e.pdf
C11 C17 C20 C112 C115 C116 = GRM188R71H104KA93D: as C62 on sheet RFID_CU Schematic; 02 Part Number: GRM188R71H104KA93D; 03 Description: Capacitor, Ceramic, 50V, ±10%, X7R, -55°C to 125°C; 04 Value: 100n; 01 Part Category: Capacitor; 09 Digikey PN: 490-1519-2-ND; ComponentLink1Description: Datasheet; ComponentLink1URL: L:\Datasheet\Capacitor\c02e.pdf
C12 = GRM1885C1H102JA01D: Capacitor, Ceramic, 50V, ±5%, C0G NP0, -55°C to 125°C; 08 Manufacturer: Murata Electronics North America; 06 Package: 0603; 12 Author: D.Grace; 05 Footprint Type: SMD; 02 Part Number: GRM1885C1H102JA01D; 03 Description: Capacitor, Ceramic, 50V, ±5%, C0G NP0, -55°C to 125°C; 04 Value: 1n; 01 Part Category: Capacitor; 09 Digikey PN: 490-1451-2-ND; ComponentLink1Description: Datasheet; ComponentLink1URL: L:\Datasheet\Capacitor\c02e.pdf
C13-C15 C23 C111 = GQM1885C1H100JB01D: as C63 on sheet RFID_CU Schematic; 02 Part Number: GQM1885C1H100JB01D; 03 Description: Capacitor, Ceramic, 50V, ±5%, NP0, -55°C to 125°C; 04 Value: 10p; 01 Part Category: Capacitor; 09 Digikey PN: 490-3570-1-ND; ComponentLink1Description: Datasheet; ComponentLink1URL: L:\Datasheet\Capacitor\c02e.pdf
C16 = GRM1885C1H101JA01D: as C93 on sheet RFID_CU Schematic; 02 Part Number: GRM1885C1H101JA01D; 03 Description: Capacitor, Ceramic, 50V, ±5%, C0G NP0, -55°C to 125°C; 04 Value: 100p; 01 Part Category: Capacitor; 09 Digikey PN: 490-1427-2-ND; 10 Alternate Supplier: Mouser; 11 Alternate Supplier PN: 81-GRM39C101J50; ComponentLink1Description: Datasheet; ComponentLink1URL: L:\Datasheet\Capacitor\c02e.pdf
C18 = GRM188R71E105KA12D: Capacitor, Ceramic, 25V, ±10%, X7R, -55°C to 125°C; 08 Manufacturer: Murata Electronics North America; 06 Package: 0603; 12 Author: D.Grace; 05 Footprint Type: SMD; 02 Part Number: GRM188R71E105KA12D; 03 Description: Capacitor, Ceramic, 25V, ±10%, X7R, -55°C to 125°C; 04 Value: 1u; 01 Part Category: Capacitor; 09 Digikey PN: 490-5307-2-ND; ComponentLink1Description: Datasheet; ComponentLink1URL: L:\Datasheet\Capacitor\c02e.pdf
C19 = C1608X5R1A106M080AC: Capacitor, Ceramic, 10V, ±20%, X5R, -55°C to 85°C; 08 Manufacturer: TDK Corporation; 04 Value: 10u; 06 Package: 0603; 12 Author: K.Sukumar; 05 Footprint Type: SMD; 02 Part Number: C1608X5R1A106M080AC; 03 Description: Capacitor, Ceramic, 10V, ±20%, X5R, -55°C to 85°C; 01 Part Category: Capacitor; 09 Digikey PN: 445-6853-2-ND; ComponentLink1Description: Datasheet; ComponentLink1URL: L:\Datasheet\Capacitor\mlcc_commercial_general_en.pdf
C21 C22 = CMP-007-0078-1: Capacitor, Ceramic, 50V, ±5%, C0G NP0, -55°C to 125°C; 02 Part Number: GRM1885C1H120JA01D; 08 Manufacturer: Murata Electronics North America; 06 Package: 0603; 12 Author: D.Grace; 05 Footprint Type: SMD; 03 Description: Capacitor, Ceramic, 50V, ±5%, C0G NP0, -55°C to 125°C; 04 Value: 12p; 01 Part Category: Capacitor; 09 Digikey PN: 490-1405-2-ND; 10 Alternate Supplier: Mouser; 11 Alternate Supplier PN: 81-GRM39C120J50; ComponentLink1Description: Datasheet; ComponentLink1URL: L:\Datasheet\Capacitor\c02e.pdf; Component Name: GRM1885C1H120JA01D
C109 = CC0603KRX5R6BB475: Capacitor, Ceramic, 10V, ±10%, X5R, -55°C to 125°C; 08 Manufacturer: Yageo; 04 Value: 470nF; 06 Package: 0603; 12 Author: K.Sukumar; 05 Footprint Type: SMD; 02 Part Number: CC0603KRX5R6BB475; 03 Description: Capacitor, Ceramic, 10V, ±10%, X5R, -55°C to 125°C; 01 Part Category: Capacitor; 09 Digikey PN: 311-1455-2-ND; ComponentLink1Description: Datasheet; ComponentLink1URL: L:\Datasheet\Capacitor\mlcc01_e.pdf
FB3 FB6 = BLM18AG102SN1D: as FB4 on sheet RFID_CU Schematic; 02 Part Number: BLM18AG102SN1D; 03 Description: Ferrite Bead, 1kohm@100MHz, 400mA, 500mohm, -55 to 125C; 04 Value: 1kohm@100MHz; ComponentLink1Description: Datasheet; ComponentLink1URL: L:\Datasheet\Filter\L0110S0100BLM18A.pdf; 09 Digikey PN: 490-1015-2-ND; 10 Alternate Supplier: BLM18AG102SN1D
J5 = LPPB052NFSS-RC: Socket,  Female, 2x5, 10 POS, Pitch 1.27mm; 01 Part Category: Connector; 08 Manufacturer: Sullins; 06 Package: SMD; 12 Author: K.Sukumar; 03 Description: Socket,  Female, 2x5, 10 POS, Pitch 1.27mm; 04 Value: LPPB052NFSS-RC; 09 Digikey PN: S9006E-05-ND; 05 Footprint Type: SMD; ComponentLink1Description: Datasheet; ComponentLink1URL: L:\Datasheet\Connector\Sullins_HEADER_.050_1.27mm_FEMALE.pdf; 02 Part Number: LPPB052NFSS-RC
R10 R43 = RC0603FR-0747KL: Resistor, Thick Film, 0.1W, ±1%, ±100ppm/°C; 08 Manufacturer: Yageo; 13 Reviewed By: P.Moutzouris; 06 Package: 0603; 12 Author: D.Grace; 05 Footprint Type: SMD; 02 Part Number: RC0603FR-0747KL; 03 Description: Resistor, Thick Film, 0.1W, ±1%, ±100ppm/°C; 04 Value: 47k; 09 Digikey PN: 311-47.0KHRTR-ND; 01 Part Category: Resistor; ComponentLink1Description: Datasheet; ComponentLink1URL: L:\Datasheet\Resistor\PYu-RC0603_51_RoHS_L_4.pdf
R11-R13 = RC0603FR-07100RL: as R29 on sheet RFID_CU Schematic; 02 Part Number: RC0603FR-07100RL; 03 Description: Resistor, Thick Film, 0.1W, ±1%, ±100ppm/°C; 04 Value: 100R; 09 Digikey PN: 311-100HRTR-ND; 01 Part Category: Resistor; ComponentLink1Description: Datasheet; ComponentLink1URL: L:\Datasheet\Resistor\PYu-RC0603_51_RoHS_L_4.pdf
TP18 TP19 TP21 TP23 TP26 TP28 TP29 TP35 TP37 TP49-TP53 = Test Point: as TP80 on sheet RFID_CU Schematic
U4 = CMP-0365-00449-2: 25 MHz Mixed Signal Microcontroller with 128 KB Flash, 16384 B SRAM and 67 GPIOs, -40 to 85 degC, 80-pin QFP (PN), Green (RoHS & no Sb/Br); Manufacturer: Texas Instruments; ADC: 12-bit SAR; Multiplier: 32x32; SRAM(B): 16384; Watchdog: Yes; Timers - 16-bit: 3; SubFamily: 5 Series; Frequency(MHz): 25; GPIO: 67; Flash(KB): 128; USCI_B (I2C & SPI): 2; ADC Channels: 16; DatasheetVersion: SLAS655B; ComponentLink3Description: Package Specification; ComponentLink1URL: http://www.ti.com/; Temp Sensor: Yes; PartNumber: MSP430F5418AIPNR; ComponentLink2Description: Datasheet; DMA: 3; ComponentLink3URL: http://www.ti.com/lit/ml/mtqf010a/mtqf010a.pdf; Brown Out Reset: Yes; Mounting Technology: Surface Mount; PackageReference: PN0080A; Eco-Plan: Green (RoHS & no Sb/Br); ComponentLink1Description: Manufacturer URL; USCI_A (UART/LIN/IrDA/SPI): 2; Code_JEDEC: MS-018; SVS: Yes; Real-Time Clock: Yes; PackageDescription: 80-Pin Plastic Quad Flat Pack, Body 12 x 12 mm, Pitch 0.5 mm; ComponentLink2URL: http://www.ti.com/general/docs/lit/getliterature.tsp?genericPartNumber=MSP430F5418A&fileType=pdf
X1 = CMP-007-0044-1: Crystal, 32.7680kHz, 9pF/12.5pF, ESR 70k, f Tolerance ±20ppm, Fundamental, -40°C to 85°C; 08 Manufacturer: Citizen Finedevice Co Ltd; 05 Footprint Type: SMD; 06 Package: 1206; 12 Author: D.Grace; 04 Value: CM315D32768DZCT; Component Name: CM315D32768DZCT; 01 Part Category: Crystal; 02 Part Number: CM315D32768DZCT; 03 Description: Crystal, 32.7680kHz, 9pF/12.5pF, ESR 70k, f Tolerance ±20ppm, Fundamental, -40°C to 85°C; 09 Digikey PN: 300-8813-2-ND; ComponentLink1Description: Datasheet; ComponentLink1URL: L:\Datasheet\Crystal\CM315D.pdf